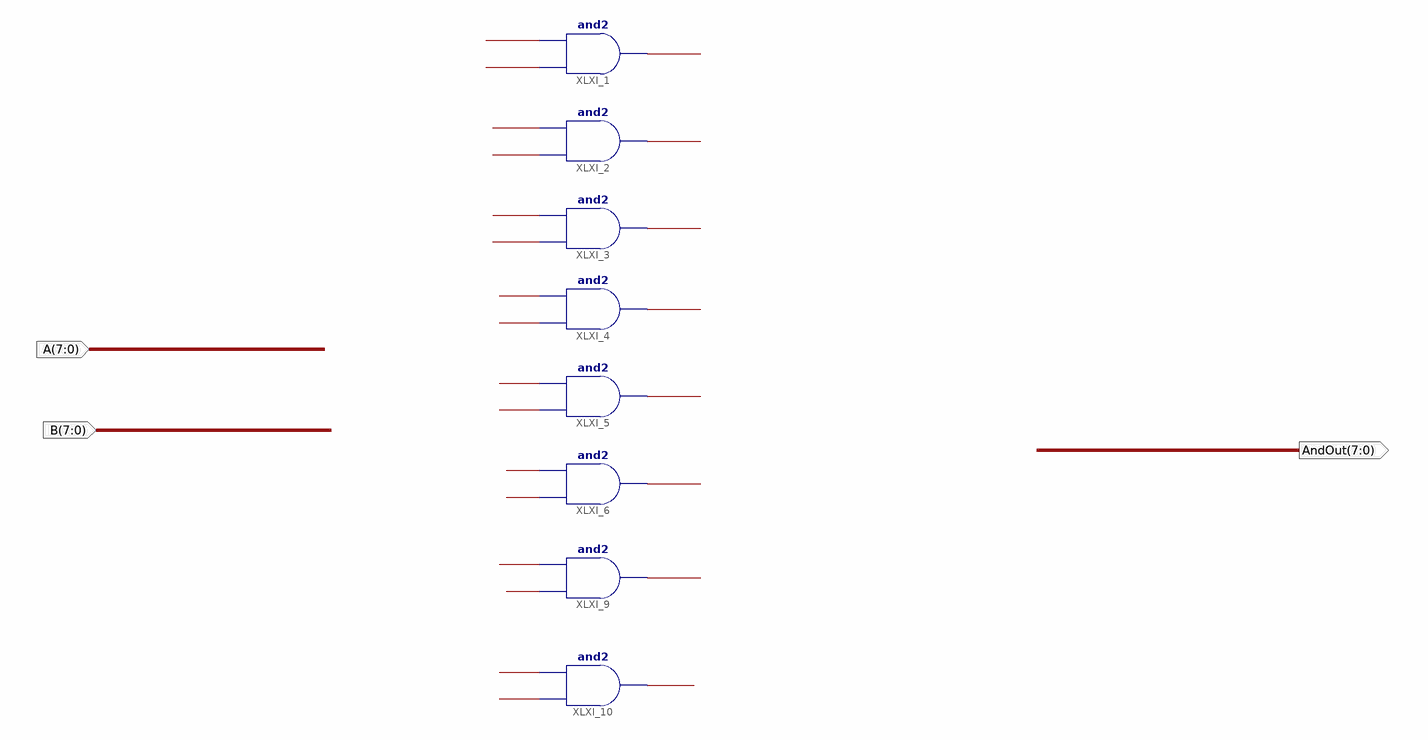
[diagram p0: schematic sheet 1]
// Xilinx ISE schematic EightBitAnd.sch (spartan6) as structural Verilog: 8 symbols, 3 ports
module EightBitAnd (
  input  [7:0] A,
  input  [7:0] B,
  output [7:0] AndOut
);

  and XLXI_1 (AndOut[0], B[0], A[0]);
  and XLXI_2 (AndOut[1], B[1], A[1]);
  and XLXI_3 (AndOut[2], B[2], A[2]);
  and XLXI_4 (AndOut[3], B[3], A[3]);
  and XLXI_5 (AndOut[4], B[4], A[4]);
  and XLXI_6 (AndOut[5], B[5], A[5]);
  and XLXI_9 (AndOut[6], B[6], A[6]);
  and XLXI_10 (AndOut[7], B[7], A[7]);
endmodule
